# Altium project INCUBATION_CONTROLLER.PrjPcb
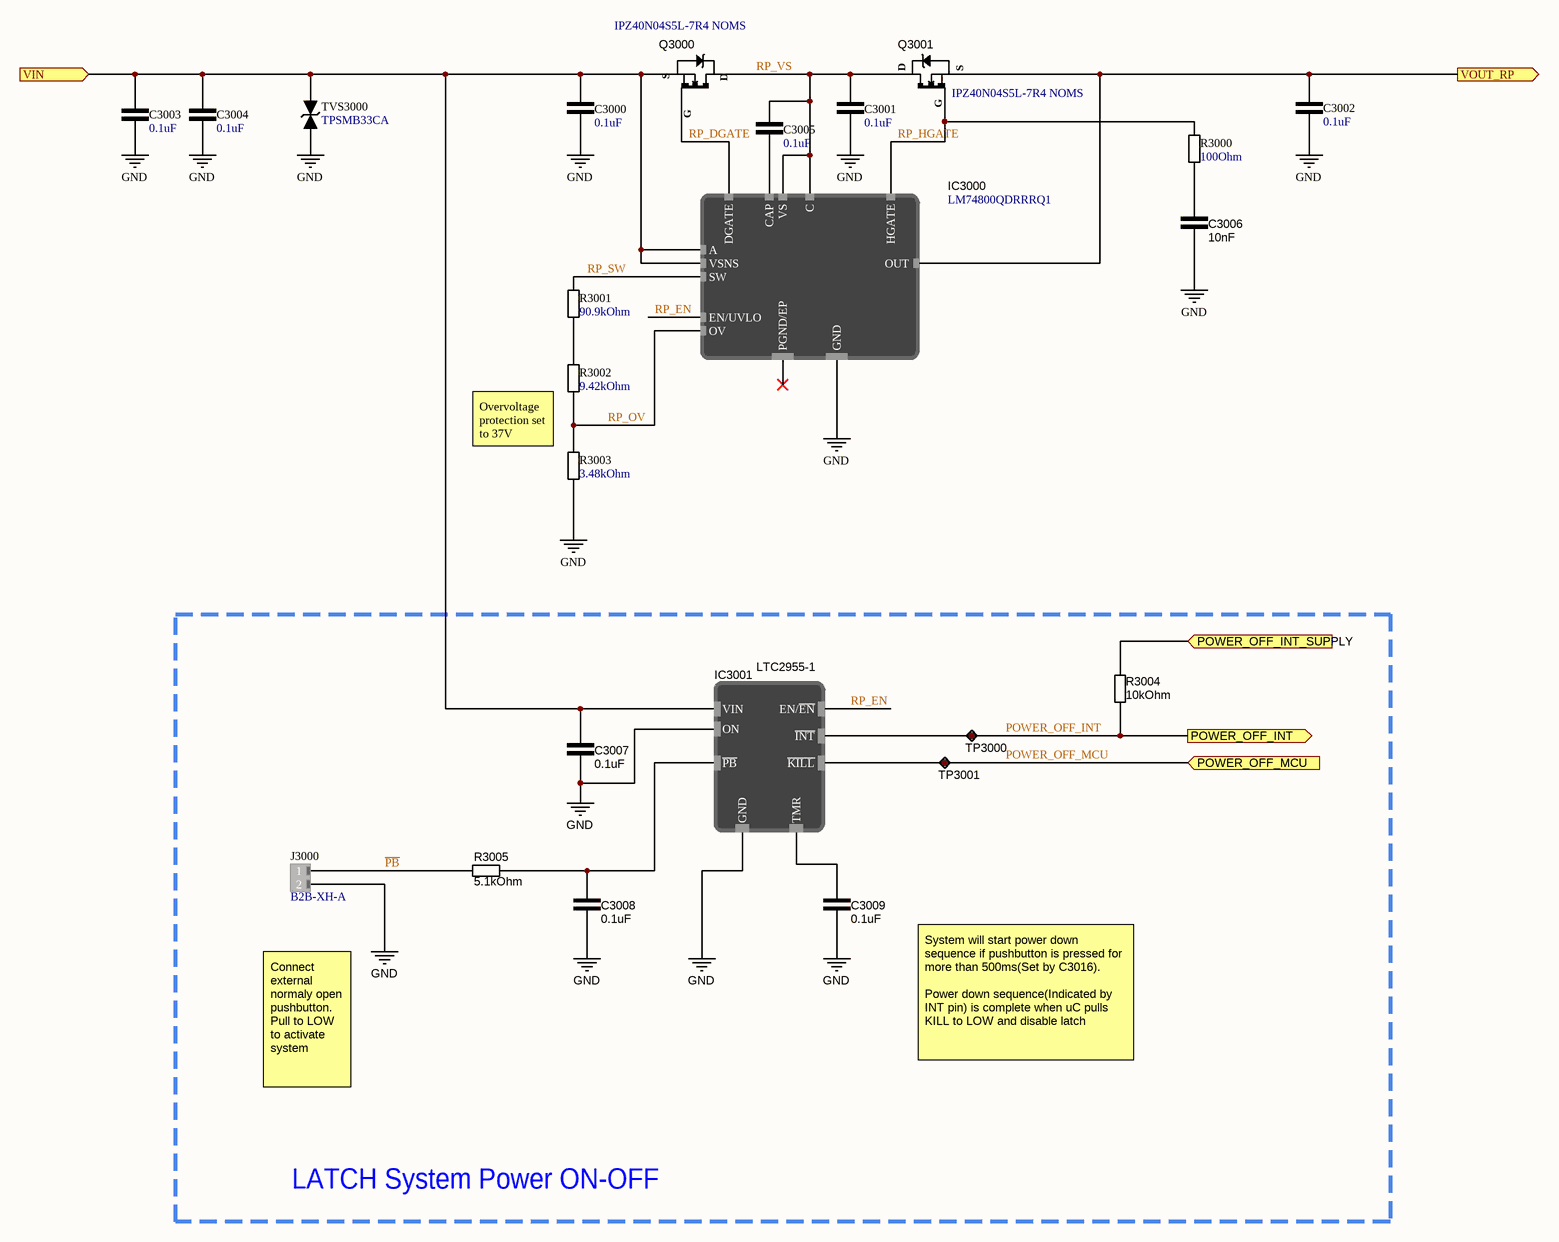
[diagram p0: REVERSE_PROTECTION.SchDoc]
8 sheets, 154 parts. Net scope: flat (ports and power ports of the same name join across sheets).
Board file: INCUBATION_CONTROLLER.PcbDoc
Sheets:
  REVERSE_PROTECTION.SchDoc
  5V_SUPPLY.SchDoc
  5V_ISOLATED_SUPPLY.SchDoc
  uSD_CARD.SchDoc
  DISPLAY_INTERFACE.SchDoc
  AC_CONTROL.SchDoc
  MOTOR_CONTROL.SchDoc
  3V3_MCU.SchDoc

## Sheet REVERSE_PROTECTION.SchDoc
size A3; SheetNumber: 3; SheetTotal: 16

### Parts
C3000  0.1uF  [CAP_0603]
C3001  0.1uF  [CAP_0603]
C3002  0.1uF  [CAP_0603]
C3003  0.1uF  [CAP_0603]
C3004  0.1uF  [CAP_0603]
C3005  0.1uF  [CAP_0603]
C3006  10nF  [CAP_0603]
C3007  0.1uF  [CAP_0603]
C3008  0.1uF  [CAP_0603]
C3009  0.1uF  [CAP_0603]
IC3000  LM74800QDRRRQ1  [SON50P300X80_HS-13N]
IC3001  LTC2955-1  [TSOP65P280X100-8N]
J3000  B2B-XH-A  [JST_XH_2POS]
Q3000  IPZ40N04S5L-7R4 NOMS  [PG-TSDSON-8-32]
Q3001  IPZ40N04S5L-7R4 NOMS  [PG-TSDSON-8-32]
R3000  100Ohm  [RES_0603]
R3001  90.9kOhm  [RES_0603]
R3002  9.42kOhm  [RES_0603]
R3003  3.48kOhm  [RES_0603]
R3004  10kOhm  [RES_0603]
R3005  5.1kOhm  [RES_0603]
TP3000  Test point  [TestPoint]  (value not drawn)
TP3001  Test point  [TestPoint]  (value not drawn)
TVS3000  TPSMB33CA  [DO-214AA]

### Ports
POWER_OFF_INT (out, see POWER_DELIVERY_AND_MONITORING[2A], POWER_DELIVERY_AND_MONITORING[1B]), POWER_OFF_INT_SUPPLY (in, see POWER_DELIVERY_AND_MONITORING[2A]), POWER_OFF_MCU (in, see POWER_DELIVERY_AND_MONITORING[2A], POWER_DELIVERY_AND_MONITORING[1B]), VIN (in, see POWER_DELIVERY_AND_MONITORING[1A]), VOUT_RP (out, see POWER_DELIVERY_AND_MONITORING[2A])

### Nets
GND: C3000.1 C3001.1 C3002.1 C3003.1 C3004.1 C3006.1 C3007.1 C3008.1 C3009.1 IC3000.7(GND) IC3001.1(ON) IC3001.4(GND) J3000.2 R3003.1 TVS3000.2(Anode)
~{PB}: J3000.1 R3005.1
POWER_OFF_INT: IC3001.8(~{INT}) R3004.1 TP3000.1 ; port POWER_OFF_INT
POWER_OFF_MCU: IC3001.2(~{KILL}) TP3001.1 ; port POWER_OFF_MCU
RP_DGATE: IC3000.1(DGATE) Q3000.G(Gate)
RP_EN: IC3000.6(EN/UVLO) IC3001.7(EN/~{EN})
RP_HGATE: IC3000.8(HGATE) Q3001.G(Gate) R3000.2
RP_OV: IC3000.5(OV) R3002.1 R3003.2
RP_SW: IC3000.4(SW) R3001.2
RP_VS: C3001.2 C3005.2 IC3000.10(VS) IC3000.12(C) Q3000.D(Drain) Q3001.D(Drain)
NetC3000_2: C3000.2 C3003.2 C3004.2 C3007.2 IC3000.2(A) IC3000.3(VSNS) IC3001.6(VIN) Q3000.S(Source) TVS3000.1(Cathode) ; port VIN
NetC3002_2: C3002.2 IC3000.9(OUT) Q3001.S(Source) ; port VOUT_RP
NetC3005_1: C3005.1 IC3000.11(CAP)
NetC3006_2: C3006.2 R3000.1
NetC3008_2: C3008.2 IC3001.5(~{PB}) R3005.2
NetC3009_2: C3009.2 IC3001.3(TMR)
NetR3001_1: R3001.1 R3002.2
NetR3004_2: R3004.2 ; port POWER_OFF_INT_SUPPLY

Not connected (* = marked no-connect by the designer): IC3000 13(PGND/EP)*

### Notes on the sheet
- Overvoltage protection set to 37V
- Connect external normaly open pushbutton.
  Pull to LOW to activate system
- System will start power down sequence if pushbutton is pressed for more than 500ms(Set by C3016).
  Power down sequence(Indicated by INT pin) is complete when uC pulls KILL to LOW and disable latch
- LATCH System Power ON-OFF

### Library data of the parts
C3000 C3001 C3005 C3007-C3009 = C000018: 0.1 µF ±10% 50V Ceramic Capacitor X7R 0603 (1608 Metric); ComponentLink1Description: DigiKey; ComponentLink1URL: https://www.digikey.com/en/products/detail/samsung-electro-mechanics/CL10B104KB8NNNC/3886658; DigiKey Part Number: 1276-1000-1-ND; capacitance: 0.1uF
C3002-C3004 = C000018: 0.1 µF ±10% 50V Ceramic Capacitor X7R 0603 (1608 Metric); Manufacturer Product Number: CL10B104KB8NNNC; capacitance: 0.1uF; ComponentLink1Description: DigiKey; ComponentLink1URL: https://www.digikey.com/en/products/detail/samsung-electro-mechanics/CL10B104KB8NNNC/3886658; DigiKey Part Number: 1276-1000-1-ND
C3006 = C000034: 10000 pF ±10% 50V Ceramic Capacitor X7R 0603 (1608 Metric); ComponentLink1Description: DigiKey; ComponentLink1URL: https://www.digikey.com/en/products/detail/kemet/C0603C103K5RACTU/411090; DigiKey Part Number: 399-C0603C103K5RACTUCT-ND; capacitance: 10nF
IC3000 = LM74800QDRRRQ1: OR Controller N+1 ORing Controller N-Channel 1:1 12-WSON (3x3); DigiKey Part Number: 296-LM74800QDRRRQ1CT-ND; ComponentLink1Description: DigiKey; ComponentLink1URL: https://www.digikey.com/en/products/detail/texas-instruments/LM74800QDRRRQ1/13627158; Mouser Part Number: 595-LM74800QDRRRQ1; ComponentLink2Description: Mouser; ComponentLink2URL: https://eu.mouser.com/ProductDetail/Texas-Instruments/LM74800QDRRRQ1?qs=KUoIvG%2F9IlYNgS7D9vQjYA%3D%3D
IC3001 = LTC2955-1: Power Supply Controller Push Button, On/Off Controller TSOT-23-8; DigiKey Part Number: 505-LTC2955CTS8-1#TRMPBFCT-ND; ComponentLink1Description: DigiKey; ComponentLink1URL: https://www.digikey.com/en/products/detail/analog-devices-inc/LTC2955CTS8-1-TRMPBF/3065178; Mouser Part Number: 584-C2955CTS8-1TMPF; ComponentLink2Description: Mouser; ComponentLink2URL: https://eu.mouser.com/ProductDetail/Analog-Devices/LTC2955CTS8-1TRMPBF?qs=hVkxg5c3xu%252B6Fq1Ir3bkGg%3D%3D
J3000 = 00000013: Connector Header Through Hole 2 position 0.098" (2.50mm); DigiKey Part Number: 455-B2B-XH-A-ND; ComponentLink1Description: DigiKey; ComponentLink1URL: https://www.digikey.com/en/products/detail/jst-sales-america-inc/B2B-XH-A/1651045; Manufacturer Product Number: B2B-XH-A
Q3000 Q3001 = 00000007: N-Channel 40 V 40A (Tc) 34W (Tc) Surface Mount PG-TSDSON-8; DigiKey Part Number: IPZ40N04S5L7R4ATMA1CT-ND; Mouser Part Number: 726-IPZ40N04S5L7R4AT; ComponentLink1Description: DigiKey; ComponentLink1URL: https://www.digikey.com/en/products/detail/infineon-technologies/IPZ40N04S5L7R4ATMA1/5960382; ComponentLink2Description: Mouser; ComponentLink2URL: https://eu.mouser.com/ProductDetail/Infineon-Technologies/IPZ40N04S5L7R4ATMA1?qs=RJIhqtkBntMJfptUOROQRQ%3D%3D; ComponentLink3Description: Footprint Drawing; ComponentLink3URL: https://www.infineon.com/cms/en/product/packages/PG-TSDSON/PG-TSDSON-8-32/#!downloads
R3000 = R000030: 100 Ohms ±1% 0.1W, 1/10W Chip Resistor 0603 (1608 Metric) Moisture Resistant Thick Film; ComponentLink1Description: DigiKey; ComponentLink1URL: https://www.digikey.com/en/products/detail/yageo/RC0603FR-07100RL/726888; resistance: 100Ohm; DigiKey Part Number: 311-100HRCT-ND
R3001 = R000027: 90.9 kOhms ±1% 0.1W, 1/10W Chip Resistor 0603 (1608 Metric) Automotive AEC-Q200 Thick Film; ComponentLink1Description: DigiKey; ComponentLink1URL: https://www.digikey.com/en/products/detail/panasonic-electronic-components/ERJ-3EKF9092V/196512; resistance: 90.9kOhm; DigiKey Part Number: P90.9KHCT-ND
R3002 = R000028: 9.42 kOhms ±1% 0.1W, 1/10W Chip Resistor 0603 (1608 Metric) Automotive AEC-Q200, Moisture Resistant Metal Film; ComponentLink1Description: DigiKey; ComponentLink1URL: https://www.digikey.com/en/products/detail/koa-speer-electronics-inc/RN73H1JTTD9421F25/10688584?s=N4IgjCBcoMxaBjKAzAhgGwM4FMA0IB7KAbXDBggF18AHAFyhAGU6AnASwDsBzEAX3xgAbPBBJIaLHkIkQMAJwAmACwjqIeoxYce-fIoAMADgCso8ZJz4ikUvIB0yxQAIA1gHkAFgFtMIdZqQIACqnOx07sgAstiomACurNh6IAC0iuZQbPHSNqRmlHwCIBm2IEmY7Jh0BKz%2BfEA; resistance: 9.42kOhm; DigiKey Part Number: 2019-RN73H1JTTD9421F25CT-ND
R3003 = R000029: 3.48 kOhms ±1% 0.1W, 1/10W Chip Resistor 0603 (1608 Metric) Automotive AEC-Q200 Thick Film; ComponentLink1Description: DigiKey; ComponentLink1URL: https://www.digikey.com/en/products/detail/stackpole-electronics-inc/RMCF0603FT3K48/1761028; resistance: 3.48kOhm; DigiKey Part Number: RMCF0603FT3K48CT-ND
R3004 = R000001: 10 kOhms ±1% 0.125W, 1/8W Chip Resistor 0603 (1608 Metric) Anti-Sulfur Thin Film; resistance: 10kOhm; ComponentLink1Description: DigiKey; ComponentLink1URL: https://www.digikey.com/en/products/detail/vishay-beyschlag-draloric-bc-components/MCT06030C1002FP500/1850440; DigiKey Part Number: MCT0603-10.0K-CFCT-ND
R3005 = R000013: 5.1 kOhms ±1% 0.1W, 1/10W Chip Resistor 0603 (1608 Metric) Moisture Resistant Thick Film; ComponentLink1Description: DigiKey; ComponentLink1URL: https://www.digikey.com/en/products/detail/yageo/RC0603FR-075K1L/727268; resistance: 5.1kOhm; DigiKey Part Number: 311-5.10KHRCT-ND
TP3000 TP3001 = TP002: Test point 1mm
TVS3000 = 00000015: 45.7V Clamp 13.3A Ipp Tvs Diode Surface Mount DO-214AA (SMBJ); DigiKey Part Number: F6323CT-ND; ComponentLink1Description: DigiKey; ComponentLink1URL: https://www.digikey.com/en/products/detail/littelfuse-inc/TPSMB33CA/4835275; Manufacturer Product Number: TPSMB33CA; JLCPCB Part Number: C224085

## Sheet 5V_SUPPLY.SchDoc
size A4; SheetNumber: 5; SheetTotal: 16
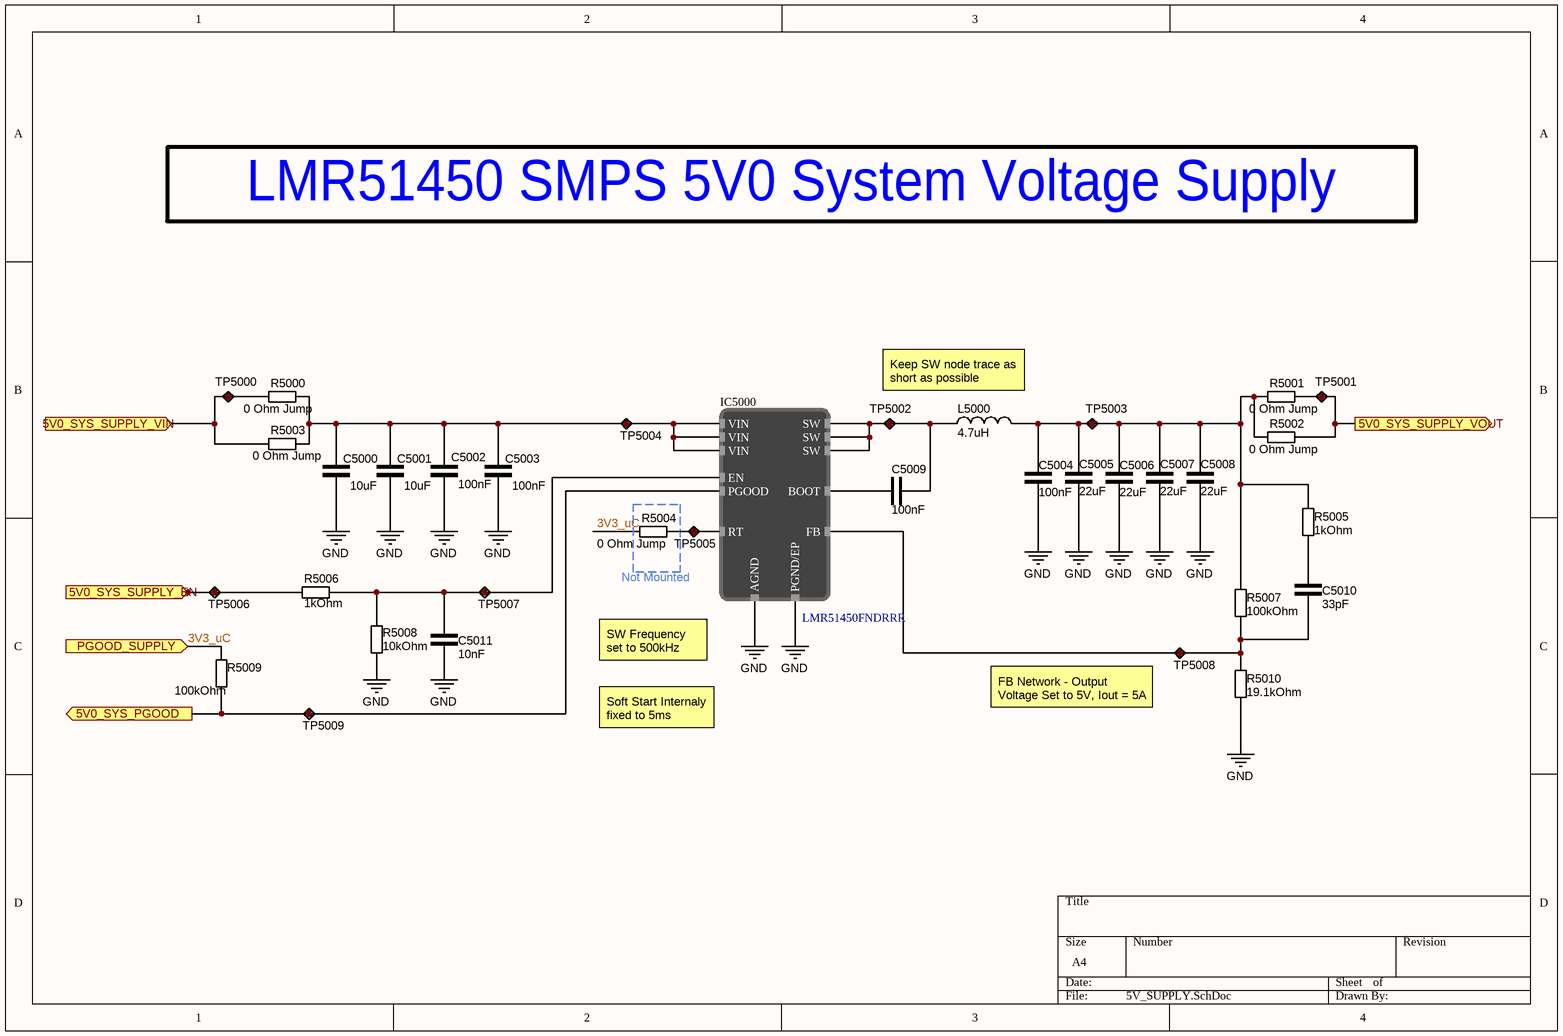
[diagram p1: 5V_SUPPLY.SchDoc]

### Parts
C5000  10uF  [CAP_0805]
C5001  10uF  [CAP_0805]
C5002  100nF  [CAP_0603]
C5003  100nF  [CAP_0603]
C5004  100nF  [CAP_0603]
C5005  22uF  [CAP_0805]
C5006  22uF  [CAP_0805]
C5007  22uF  [CAP_0805]
C5008  22uF  [CAP_0805]
C5009  100nF  [CAP_0603]
C5010  33pF  [CAP_0603]
C5011  10nF  [CAP_0603]
IC5000  LMR51450FNDRRR  [SON50P300X80_HS-13N]
L5000  4.7uH  [INDP6965X30N]
R5000  0 Ohm Jump  [RES_0805]
R5001  0 Ohm Jump  [RES_1206]
R5002  0 Ohm Jump  [RES_1206]
R5003  0 Ohm Jump  [RES_0805]
R5004  0 Ohm Jump  [RES_0603]
R5005  1kOhm  [RES_0603]
R5006  1kOhm  [RES_0603]
R5007  100kOhm  [RES_0603]
R5008  10kOhm  [RES_0603]
R5009  100kOhm  [RES_0603]
R5010  19.1kOhm  [RES_0603]
TP5000  Test point  [TestPoint]  (value not drawn)
TP5001  Test point  [TestPoint]  (value not drawn)
TP5002  Test point  [TestPoint]  (value not drawn)
TP5003  Test point  [TestPoint]  (value not drawn)
TP5004  Test point  [TestPoint]  (value not drawn)
TP5005  Test point  [TestPoint]  (value not drawn)
TP5006  Test point  [TestPoint]  (value not drawn)
TP5007  Test point  [TestPoint]  (value not drawn)
TP5008  Test point  [TestPoint]  (value not drawn)
TP5009  Test point  [TestPoint]  (value not drawn)

### Ports
5V0_SYS_PGOOD (out, see POWER_DELIVERY_AND_MONITORING[3B]), 5V0_SYS_SUPPLY_EN (in, see POWER_DELIVERY_AND_MONITORING[3B]), 5V0_SYS_SUPPLY_VIN (in, see POWER_DELIVERY_AND_MONITORING[3B]), 5V0_SYS_SUPPLY_VOUT (out, see POWER_DELIVERY_AND_MONITORING[3B]), PGOOD_SUPPLY (in, see POWER_DELIVERY_AND_MONITORING[3B])

### Nets
GND: C5000.1 C5001.1 C5002.2 C5003.1 C5004.1 C5005.1 C5006.2 C5007.1 C5008.1 C5011.1 IC5000.8(AGND) IC5000.13(PGND/EP) R5008.1 R5010.1
3V3_uC: R5004.1 R5009.2 ; port PGOOD_SUPPLY
NetC5000_2: C5000.2 C5001.2 C5002.1 C5003.2 IC5000.10(VIN) IC5000.11(VIN) IC5000.12(VIN) R5000.2 R5003.2 TP5004.1
NetC5004_2: C5004.2 C5005.2 C5006.1 C5007.2 C5008.2 L5000.2 R5001.1 R5002.1 R5005.2 R5007.2 TP5003.1
NetC5009_1: C5009.1 IC5000.4(BOOT)
NetC5009_2: C5009.2 IC5000.1(SW) IC5000.2(SW) IC5000.3(SW) L5000.1 TP5002.1
NetC5010_1: C5010.1 IC5000.7(FB) R5007.1 R5010.2 TP5008.1
NetC5010_2: C5010.2 R5005.1
NetC5011_2: C5011.2 IC5000.9(EN) R5006.2 R5008.2 TP5007.1
NetIC5000_5: IC5000.5(PGOOD) R5009.1 TP5009.1 ; port 5V0_SYS_PGOOD
NetIC5000_6: IC5000.6(RT) R5004.2 TP5005.1
NetR5000_1: R5000.1 R5003.1 TP5000.1 ; port 5V0_SYS_SUPPLY_VIN
NetR5001_2: R5001.2 R5002.2 TP5001.1 ; port 5V0_SYS_SUPPLY_VOUT
NetR5006_1: R5006.1 TP5006.1 ; port 5V0_SYS_SUPPLY_EN

### Notes on the sheet
- LMR51450 SMPS 5V0 System Voltage Supply
- Keep SW node trace as short as possible
- Not Mounted
- (near IC5000) SW Frequency set to 500kHz
- (near TP5008) FB Network - Output Voltage Set to 5V, Iout = 5A
- Soft Start Internaly fixed to 5ms

### Library data of the parts
C5000 C5001 = C000002: 10 µF ±10% 25V Ceramic Capacitor X5R 0805 (2012 Metric); ComponentLink1Description: DigiKey; ComponentLink1URL: https://www.digikey.com/en/products/detail/tdk-corporation/C2012X5R1E106K125AB/2443462; DigiKey Part Number: 445-5984-1-ND; capacitance: 10uF
C5002-C5004 C5009 = C000007: 0.1 µF ±10% 25V Ceramic Capacitor X7R 0603 (1608 Metric); ComponentLink1Description: DigiKey; ComponentLink1URL: https://www.digikey.com/en/products/detail/kyocera-avx/06033C104K4T2A/8019250; DigiKey Part Number: 478-KAM15AR71E104KTCT-ND; capacitance: 100nF
C5005-C5008 = C000001: 22 µF ±20% 25V Ceramic Capacitor X5R 0805 (2012 Metric); ComponentLink1Description: DigiKey; ComponentLink1URL: https://www.digikey.com/en/products/detail/tdk-corporation/C2012X5R1E226M125AC/3661564; DigiKey Part Number: 445-9112-1-ND; capacitance: 22uF
C5010 = C000029: 33 pF ±5% 25V Ceramic Capacitor C0G, NP0 0603 (1608 Metric); ComponentLink1Description: DigiKey; ComponentLink1URL: https://www.digikey.com/en/products/detail/yageo/CC0603JRNPO8BN330/5883595; DigiKey Part Number: 311-3954-1-ND; capacitance: 33pF
C5011 = C000005: 10000 pF ±20% 25V Ceramic Capacitor X7R 0603 (1608 Metric); ComponentLink1Description: DigiKey; ComponentLink1URL: https://www.digikey.com/en/products/detail/kyocera-avx/06033C103MAT2A/1599370; DigiKey Part Number: 478-KGM15AR71E103MTCT-ND; capacitance: 10nF
IC5000 = LMR51450FNDRRR: Buck Switching Regulator IC Positive Adjustable 0.8V 1 Output 5A 12-WFDFN Exposed Pad; DigiKey Part Number: 296-LMR51450FNDRRRCT-ND; ComponentLink1Description: DigiKey; ComponentLink1URL: https://www.digikey.com/en/products/detail/texas-instruments/LMR51450FNDRRR/17395218; Mouser Part Number: 595-LMR51450FNDRRR; ComponentLink2Description: Mouser; ComponentLink2URL: https://eu.mouser.com/ProductDetail/Texas-Instruments/LMR51450FNDRRR?qs=rQFj71Wb1eVWWBj0Ni4OAA%3D%3D; Manufacturer Product Number: LMR51450FNDRRR; JLCPCB Part Number: C5782413
L5000 = L000011: FIXED IND 4.7UH 5.5A 40 MOHM SMD; inductance: 4.7uH; DigiKey Part Number: 541-1010-1-ND; ComponentLink1Description: DigiKey; ComponentLink1URL: https://www.digikey.com/en/products/detail/vishay-dale/IHLP2525CZER4R7M01/1220675
R5000 R5003 = R000011: 0 Ohms Jumper Chip Resistor 0805 (2012 Metric) Automotive AEC-Q200 Thick Film; ComponentLink1Description: DigiKey; ComponentLink1URL: https://www.digikey.com/en/products/detail/panasonic-electronic-components/ERJ-6GEY0R00V/78163; resistance: 0 Ohm Jump; DigiKey Part Number: P0.0ACT-ND
R5001 R5002 = R000012: 0 Ohms Jumper Chip Resistor 1206 (3216 Metric) Automotive AEC-Q200 Thick Film; ComponentLink1Description: DigiKey; ComponentLink1URL: https://www.digikey.com/en/products/detail/stackpole-electronics-inc/RMCF1206ZT0R00/1756906; resistance: 0 Ohm Jump; DigiKey Part Number: RMCF1206ZT0R00CT-ND
R5004 = R000007: 0 Ohms Jumper Chip Resistor 0603 (1608 Metric) Automotive AEC-Q200 Thick Film; ComponentLink1Description: DigiKey; ComponentLink1URL: https://www.digikey.com/en/products/detail/stackpole-electronics-inc/RMCF0603ZT0R00/1756908; resistance: 0 Ohm Jump; DigiKey Part Number: RMCF0603ZT0R00CT-ND
R5005 R5006 = R000004: 1 kOhms ±1% 0.125W, 1/8W Chip Resistor 0603 (1608 Metric) Anti-Sulfur Thin Film; resistance: 1kOhm; ComponentLink1Description: DigiKey; ComponentLink1URL: https://www.digikey.com/en/products/detail/vishay-beyschlag-draloric-bc-components/MCT06030C1001FP500/2607821; DigiKey Part Number: MCT0603-1.00K-CFCT-ND
R5007 R5009 = R000006: 100 kOhms ±1% 0.1W, 1/10W Chip Resistor 0603 (1608 Metric) Automotive AEC-Q200 Thick Film; resistance: 100kOhm; ComponentLink1Description: DigiKey; ComponentLink1URL: https://www.digikey.com/en/products/detail/stackpole-electronics-inc/RMCF0603FG100K/1713543; DigiKey Part Number: RMCF0603FG100KCT-ND
R5008 = R000001: as R3004 on sheet REVERSE_PROTECTION; resistance: 10kOhm; ComponentLink1Description: DigiKey; ComponentLink1URL: https://www.digikey.com/en/products/detail/vishay-beyschlag-draloric-bc-components/MCT06030C1002FP500/1850440; DigiKey Part Number: MCT0603-10.0K-CFCT-ND
R5010 = R000020: 19.1 kOhms ±1% 0.1W, 1/10W Chip Resistor 0603 (1608 Metric) Moisture Resistant Thick Film; ComponentLink1Description: DigiKey; ComponentLink1URL: https://www.digikey.com/en/products/detail/yageo/RC0603FR-0719K1L/727001; resistance: 19.1kOhm; DigiKey Part Number: 311-19.1KHRCT-ND
TP5000-TP5009 = TP002: Test point 1mm

## Sheet 5V_ISOLATED_SUPPLY.SchDoc
size A4; SheetNumber: 6; SheetTotal: 16
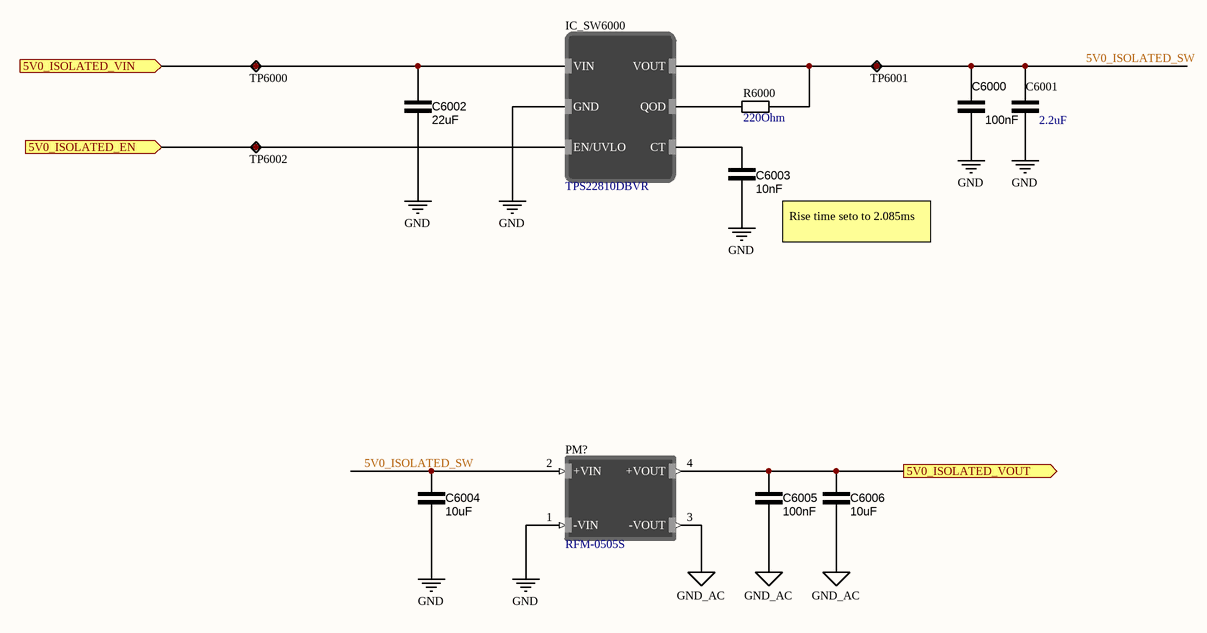
[diagram p2: 5V_ISOLATED_SUPPLY.SchDoc]

### Parts
C6000  100nF  [CAP_0603]
C6001  2.2uF  [CAP_0603]
C6002  22uF  [CAP_0805]
C6003  10nF  [CAP_0603]
C6004  10uF  [CAP_0805]
C6005  100nF  [CAP_0603]
C6006  10uF  [CAP_0805]
IC_SW6000  TPS22810DBVR  [SOT95P280X145-6N]
PM?  RFM-0505S  [CONV_RFM-0505S]
R6000  220Ohm  [RES_0603]
TP6000  Test point  [TestPoint]  (value not drawn)
TP6001  Test point  [TestPoint]  (value not drawn)
TP6002  Test point  [TestPoint]  (value not drawn)

### Ports
5V0_ISOLATED_EN (in, see POWER_DELIVERY_AND_MONITORING[2C]), 5V0_ISOLATED_VIN (in, see POWER_DELIVERY_AND_MONITORING[2C]), 5V0_ISOLATED_VOUT (out, see POWER_DELIVERY_AND_MONITORING[2C])

### Nets
GND: C6000.2 C6001.1 C6002.1 C6003.1 C6004.1 IC_SW6000.2(GND) PM?.1(-VIN)
GND_AC: C6005.1 C6006.1 PM?.3(-VOUT)
5V0_ISOLATED_SW: C6000.1 C6001.2 C6004.2 IC_SW6000.6(VOUT) PM?.2(+VIN) R6000.2 TP6001.1
NetC6002_2: C6002.2 IC_SW6000.1(VIN) TP6000.1 ; port 5V0_ISOLATED_VIN
NetC6003_2: C6003.2 IC_SW6000.4(CT)
NetC6005_2: C6005.2 C6006.2 PM?.4(+VOUT) ; port 5V0_ISOLATED_VOUT
NetIC_SW6000_3: IC_SW6000.3(EN/UVLO) TP6002.1 ; port 5V0_ISOLATED_EN
NetIC_SW6000_5: IC_SW6000.5(QOD) R6000.1

### Notes on the sheet
- (near C6003) Rise time seto to 2.085ms

### Library data of the parts
C6000 = C000007: as C5002 on sheet 5V_SUPPLY; ComponentLink1Description: DigiKey; ComponentLink1URL: https://www.digikey.com/en/products/detail/kyocera-avx/06033C104K4T2A/8019250; DigiKey Part Number: 478-KAM15AR71E104KTCT-ND; capacitance: 100nF
C6001 = C000014: 8 pF ±0.05pF 25V Ceramic Capacitor C0G, NP0 01005 (0402 Metric); ComponentLink1Description: DigiKey; ComponentLink1URL: https://www.digikey.com/en/products/detail/murata-electronics/GRM188C71C225KE11D/4905311; DigiKey Part Number: 490-12731-1-ND; capacitance: 2.2uF
C6002 = C000001: as C5005 on sheet 5V_SUPPLY; ComponentLink1Description: DigiKey; ComponentLink1URL: https://www.digikey.com/en/products/detail/tdk-corporation/C2012X5R1E226M125AC/3661564; DigiKey Part Number: 445-9112-1-ND; capacitance: 22uF
C6003 = C000005: as C5011 on sheet 5V_SUPPLY; ComponentLink1Description: DigiKey; ComponentLink1URL: https://www.digikey.com/en/products/detail/kyocera-avx/06033C103MAT2A/1599370; DigiKey Part Number: 478-KGM15AR71E103MTCT-ND; capacitance: 10nF
C6004 C6006 = C000002: 10 µF ±10% 25V Ceramic Capacitor X5R 0805 (2012 Metric); Manufacturer Product Number: C2012X5R1E106K125AB; capacitance: 10uF; ComponentLink1Description: DigiKey; ComponentLink1URL: https://www.digikey.com/en/products/detail/tdk-corporation/C2012X5R1E106K125AB/2443462; DigiKey Part Number: 445-5984-1-ND
C6005 = C000007: 0.1 µF ±10% 25V Ceramic Capacitor X7R 0603 (1608 Metric); Manufacturer Product Number: KAM15AR71E104KT; capacitance: 100nF; ComponentLink1Description: DigiKey; ComponentLink1URL: https://www.digikey.com/en/products/detail/kyocera-avx/06033C104K4T2A/8019250; DigiKey Part Number: 478-KAM15AR71E104KTCT-ND
IC_SW6000 = TPS22810: Power Switch/Driver 1:1 N-Channel 2A SOT-23-6; DigiKey Part Number: 296-45297-1-ND; Mouser Part Number: 595-TPS22810DBVR; ComponentLink1Description: DigiKey; ComponentLink1URL: https://www.digikey.com/en/products/detail/texas-instruments/TPS22810DBVR/6595640; ComponentLink2Description: Mouser; ComponentLink2URL: https://eu.mouser.com/ProductDetail/Texas-Instruments/TPS22810DBVR?qs=34RfhUjJmKcFqeJVMZZhPA%3D%3D
PM? = RFM-0505S: Isolated Module DC DC Converter 1 Output 5V 200mA - 5V Input; DigiKey Part Number: 945-3159-ND; Mouser Part Number: 919-RFM-0505S; Manufacturer Product Number: RFM-0505S; JLCPCB Part Number: C22371855; ComponentLink1Description: DigiKey; ComponentLink1URL: https://www.digikey.com/en/products/detail/recom-power/RFM-0505S/8550767; ComponentLink2Description: Mouser; ComponentLink2URL: https://eu.mouser.com/ProductDetail/RECOM-Power/RFM-0505S?qs=lYGu3FyN48dRVYKTH5ipqg%3D%3D
R6000 = R000021: 220 Ohms ±5% 0.1W, 1/10W Chip Resistor 0603 (1608 Metric) Automotive AEC-Q200 Thick Film; ComponentLink1Description: DigiKey; ComponentLink1URL: https://www.digikey.com/en/products/detail/panasonic-electronic-components/ERJ-3GEYJ221V/135719; resistance: 220Ohm; DigiKey Part Number: P220GCT-ND
TP6000-TP6002 = TP002: Test point 1mm

## Sheet uSD_CARD.SchDoc
size A4; SheetNumber: 9; SheetTotal: 16
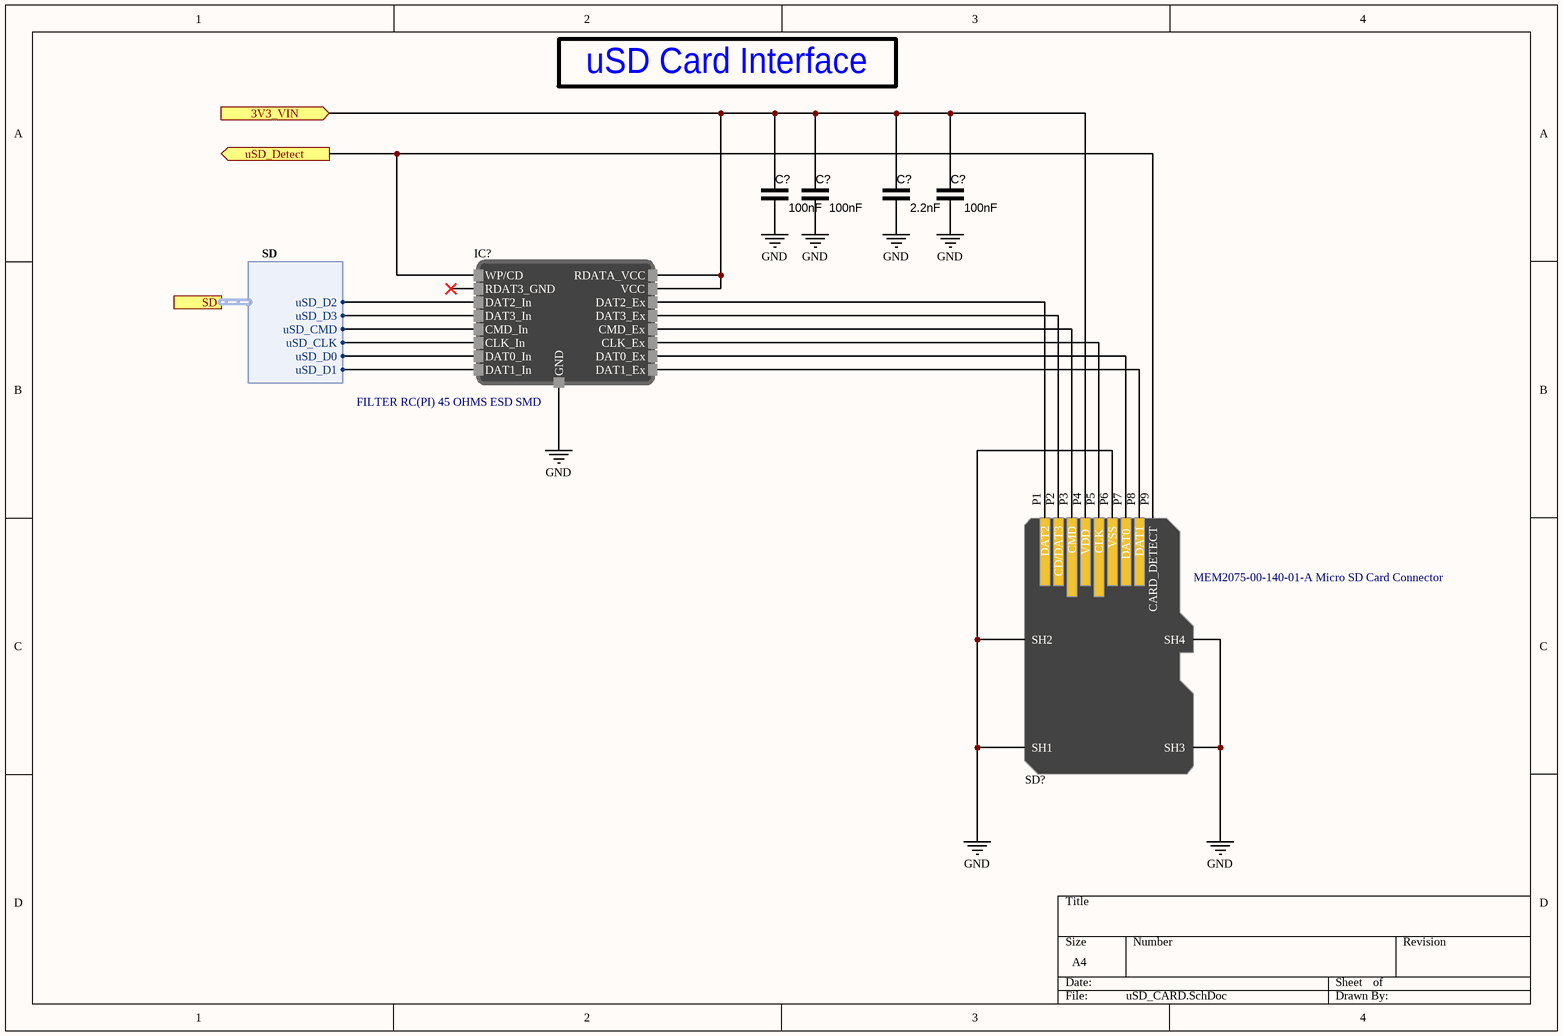
[diagram p3: uSD_CARD.SchDoc]

### Parts
(Parts that share a designator on the sheet are numbered #1, #2 ... from top to bottom, then left to right.)
C?#1  100nF  [CAP_0603]
C?#2  100nF  [CAP_0603]
C?#3  2.2nF  [CAP_0603]
C?#4  100nF  [CAP_0603]
IC?#1  FILTER RC(PI) 45 OHMS ESD SMD  [Micro QFN 3.5x1.2-16L]
SD?  MEM2075-00-140-01-A Micro SD Card Connector  [uSD_CARD_9(8+1)]

### Ports
3V3_VIN (in), SD (harness SD), uSD_Detect (out)

### Harnesses
SD: uSD_D2, uSD_D3, uSD_CMD, uSD_CLK, uSD_D0, uSD_D1

### Nets
GND: C?#1.1 C?#2.1 C?#3.1 C?#4.1 IC?#1.17(GND) SD?.P6(VSS) SD?.SH1 SD?.SH2 SD?.SH3 SD?.SH4
NetC?#1_2: C?#1.2 C?#2.2 C?#3.2 C?#4.2 IC?#1.15(VCC) IC?#1.16(RDATA_VCC) SD?.P4(VDD) ; port 3V3_VIN
NetIC?#1_1: IC?#1.1(WP/CD) SD?.P9(CARD_DETECT) ; port uSD_Detect
NetIC?#1_3: IC?#1.3(DAT2_In) ; port SD.uSD_D2
NetIC?#1_4: IC?#1.4(DAT3_In) ; port SD.uSD_D3
NetIC?#1_5: IC?#1.5(CMD_In) ; port SD.uSD_CMD
NetIC?#1_6: IC?#1.6(CLK_In) ; port SD.uSD_CLK
NetIC?#1_7: IC?#1.7(DAT0_In) ; port SD.uSD_D0
NetIC?#1_8: IC?#1.8(DAT1_In) ; port SD.uSD_D1
NetIC?#1_9: IC?#1.9(DAT1_Ex) SD?.P8(DAT1)
NetIC?#1_10: IC?#1.10(DAT0_Ex) SD?.P7(DAT0)
NetIC?#1_11: IC?#1.11(CLK_Ex) SD?.P5(CLK)
NetIC?#1_12: IC?#1.12(CMD_Ex) SD?.P3(CMD)
NetIC?#1_13: IC?#1.13(DAT3_Ex) SD?.P2(CD/DAT3)
NetIC?#1_14: IC?#1.14(DAT2_Ex) SD?.P1(DAT2)

Not connected (* = marked no-connect by the designer): IC?#1 2(RDAT3_GND)*

### Notes on the sheet
- uSD Card Interface

### Library data of the parts
C?#1 C?#2 C?#4 = C000007: as C5002 on sheet 5V_SUPPLY; ComponentLink1Description: DigiKey; ComponentLink1URL: https://www.digikey.com/en/products/detail/kyocera-avx/06033C104K4T2A/8019250; DigiKey Part Number: 478-KAM15AR71E104KTCT-ND; capacitance: 100nF
C?#3 = C000006: 2200 pF ±10% 25V Ceramic Capacitor X7R 0603 (1608 Metric); ComponentLink1Description: DigiKey; ComponentLink1URL: https://www.digikey.com/en/products/detail/yageo/CC0603KRX7R8BB222/2345066; DigiKey Part Number: 311-3653-1-ND; capacitance: 2.2nF
IC?#1 = EMIF06-MSD02N16: RC (Pi) EMI Filter 2nd Order Low Pass 6 Channel R = 45Ohms, C = 20pF (Total) 16-UFDFN Exposed Pad; Digikey Part Number: 497-8751-1-ND; Digikey Link: https://www.digikey.com/en/products/detail/stmicroelectronics/EMIF06-MSD02N16/2043592?s=N4IgTCBcDaIKIFkCSAxADANgLQIMoBE0wA5ARgxAF0BfIA
SD? = 00000015: 9 (8 + 1) Position Card Connector Secure Digital - microSD™ Surface Mount, Right Angle Gold; DigiKey Part Number: 2073-MEM2075-00-140-01-ACT-ND; Mouser Part Number: 640-MEM20750014001A; ComponentLink1Description: DigiKey; ComponentLink1URL: https://www.digikey.com/en/products/detail/gct/MEM2075-00-140-01-A/9859614?s=N4IgTCBcDaILIFE5gAwHYCsBaFKsEYAWPFfLAQRAF0BfIA; ComponentLink2Description: Mouser; ComponentLink2URL: https://eu.mouser.com/ProductDetail/GCT/MEM2075-00-140-01-A?qs=KUoIvG%2F9IlZvfWpeERlq3Q%3D%3D

## Sheet DISPLAY_INTERFACE.SchDoc
size A4; SheetNumber: 10; SheetTotal: 16
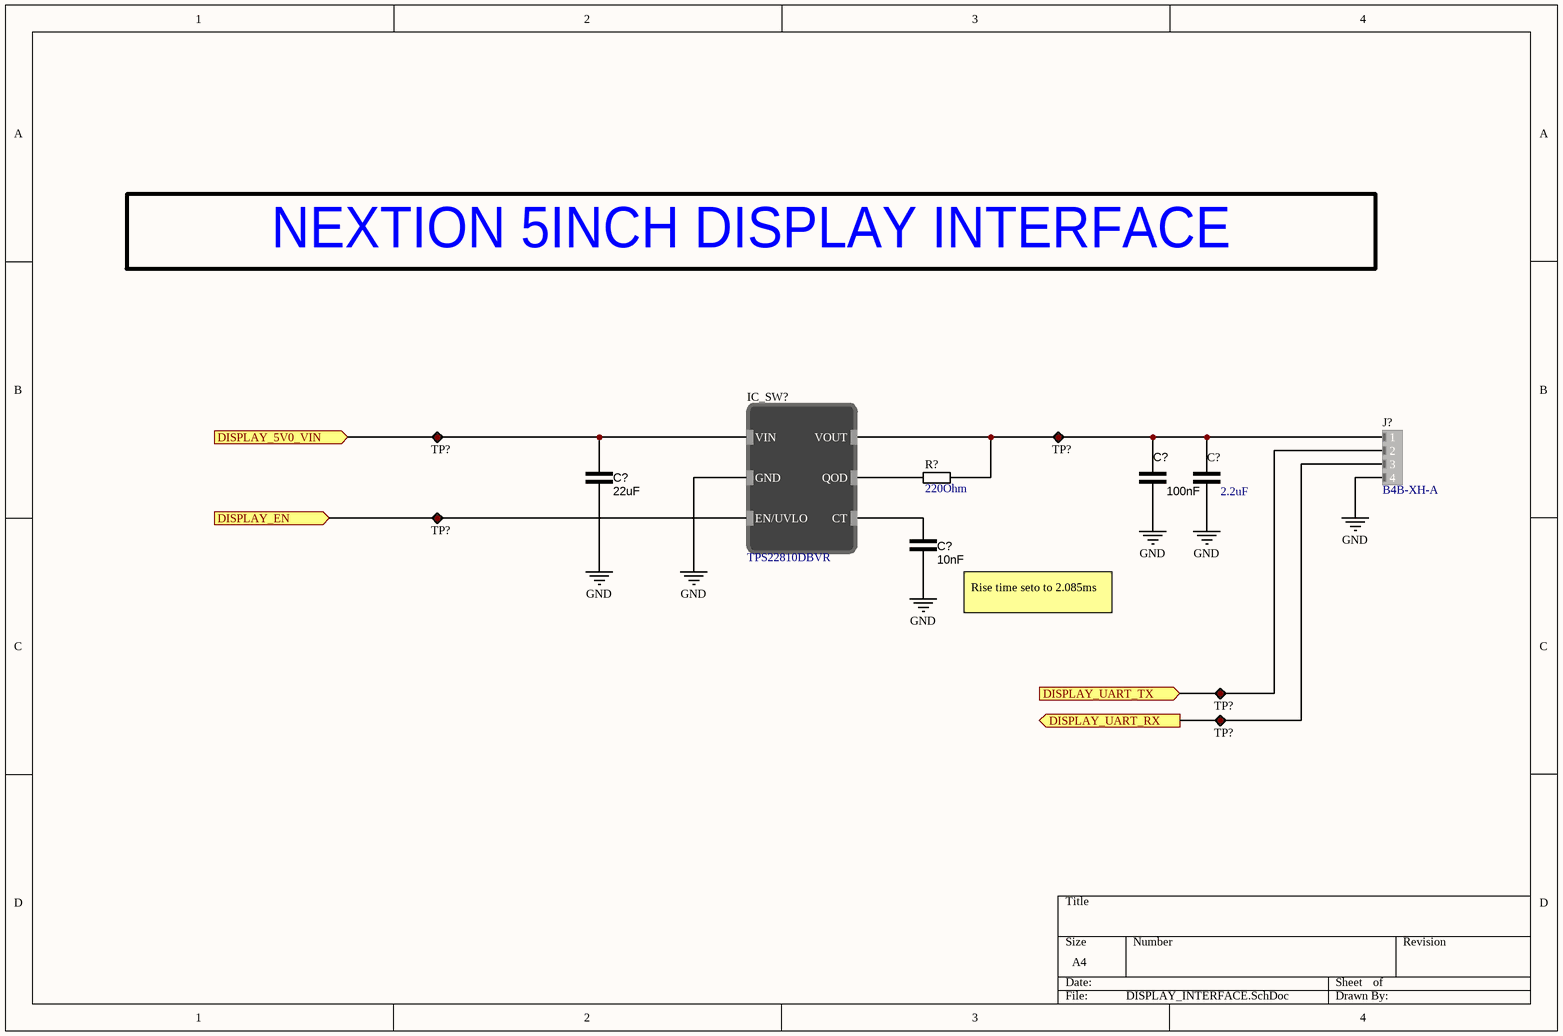
[diagram p4: DISPLAY_INTERFACE.SchDoc]

### Parts
(Parts that share a designator on the sheet are numbered #1, #2 ... from top to bottom, then left to right.)
C?#5  22uF  [CAP_0805]
C?#6  100nF  [CAP_0603]
C?#7  2.2uF  [CAP_0603]
C?#8  10nF  [CAP_0603]
IC_SW?  TPS22810DBVR  [SOT95P280X145-6N]
J?  B4B-XH-A  [JST_XH_4POS]
R?#1  220Ohm  [RES_0603]
TP?#1  Test point  [TestPoint]  (value not drawn)
TP?#2  Test point  [TestPoint]  (value not drawn)
TP?#3  Test point  [TestPoint]  (value not drawn)
TP?#4  Test point  [TestPoint]  (value not drawn)
TP?#5  Test point  [TestPoint]  (value not drawn)

### Ports
DISPLAY_5V0_VIN (in), DISPLAY_EN (in), DISPLAY_UART_RX (out), DISPLAY_UART_TX (in)

### Nets
GND: C?#5.1 C?#6.2 C?#7.1 C?#8.1 IC_SW?.2(GND) J?.4
NetC?#5_2: C?#5.2 IC_SW?.1(VIN) TP?#1.1 ; port DISPLAY_5V0_VIN
NetC?#6_1: C?#6.1 C?#7.2 IC_SW?.6(VOUT) J?.1 R?#1.2 TP?#2.1
NetC?#8_2: C?#8.2 IC_SW?.4(CT)
NetIC_SW?_3: IC_SW?.3(EN/UVLO) TP?#3.1 ; port DISPLAY_EN
NetIC_SW?_5: IC_SW?.5(QOD) R?#1.1
NetJ?_2: J?.2 TP?#4.1 ; port DISPLAY_UART_TX
NetJ?_3: J?.3 TP?#5.1 ; port DISPLAY_UART_RX

### Notes on the sheet
- NEXTION 5INCH DISPLAY INTERFACE
- (near C?#8) Rise time seto to 2.085ms

### Library data of the parts
C?#5 = C000001: as C5005 on sheet 5V_SUPPLY; ComponentLink1Description: DigiKey; ComponentLink1URL: https://www.digikey.com/en/products/detail/tdk-corporation/C2012X5R1E226M125AC/3661564; DigiKey Part Number: 445-9112-1-ND; capacitance: 22uF
C?#6 = C000007: as C5002 on sheet 5V_SUPPLY; ComponentLink1Description: DigiKey; ComponentLink1URL: https://www.digikey.com/en/products/detail/kyocera-avx/06033C104K4T2A/8019250; DigiKey Part Number: 478-KAM15AR71E104KTCT-ND; capacitance: 100nF
C?#7 = C000014: as C6001 on sheet 5V_ISOLATED_SUPPLY; ComponentLink1Description: DigiKey; ComponentLink1URL: https://www.digikey.com/en/products/detail/murata-electronics/GRM188C71C225KE11D/4905311; DigiKey Part Number: 490-12731-1-ND; capacitance: 2.2uF
C?#8 = C000005: as C5011 on sheet 5V_SUPPLY; ComponentLink1Description: DigiKey; ComponentLink1URL: https://www.digikey.com/en/products/detail/kyocera-avx/06033C103MAT2A/1599370; DigiKey Part Number: 478-KGM15AR71E103MTCT-ND; capacitance: 10nF
IC_SW? = TPS22810: as IC_SW6000 on sheet 5V_ISOLATED_SUPPLY; DigiKey Part Number: 296-45297-1-ND; Mouser Part Number: 595-TPS22810DBVR; ComponentLink1Description: DigiKey; ComponentLink1URL: https://www.digikey.com/en/products/detail/texas-instruments/TPS22810DBVR/6595640; ComponentLink2Description: Mouser; ComponentLink2URL: https://eu.mouser.com/ProductDetail/Texas-Instruments/TPS22810DBVR?qs=34RfhUjJmKcFqeJVMZZhPA%3D%3D
J? = 00000014: Connector Header Through Hole 4 position 0.098" (2.50mm); DigiKey Part Number: 455-B4B-XH-A-ND; ComponentLink1Description: DigiKey; ComponentLink1URL: https://www.digikey.com/en/products/detail/jst-sales-america-inc/B4B-XH-A/1651047
R?#1 = R000021: as R6000 on sheet 5V_ISOLATED_SUPPLY; ComponentLink1Description: DigiKey; ComponentLink1URL: https://www.digikey.com/en/products/detail/panasonic-electronic-components/ERJ-3GEYJ221V/135719; resistance: 220Ohm; DigiKey Part Number: P220GCT-ND
TP?#1-TP?#5 = TP002: Test point 1mm

## Sheet AC_CONTROL.SchDoc
size A3; SheetNumber: 12; SheetTotal: 15
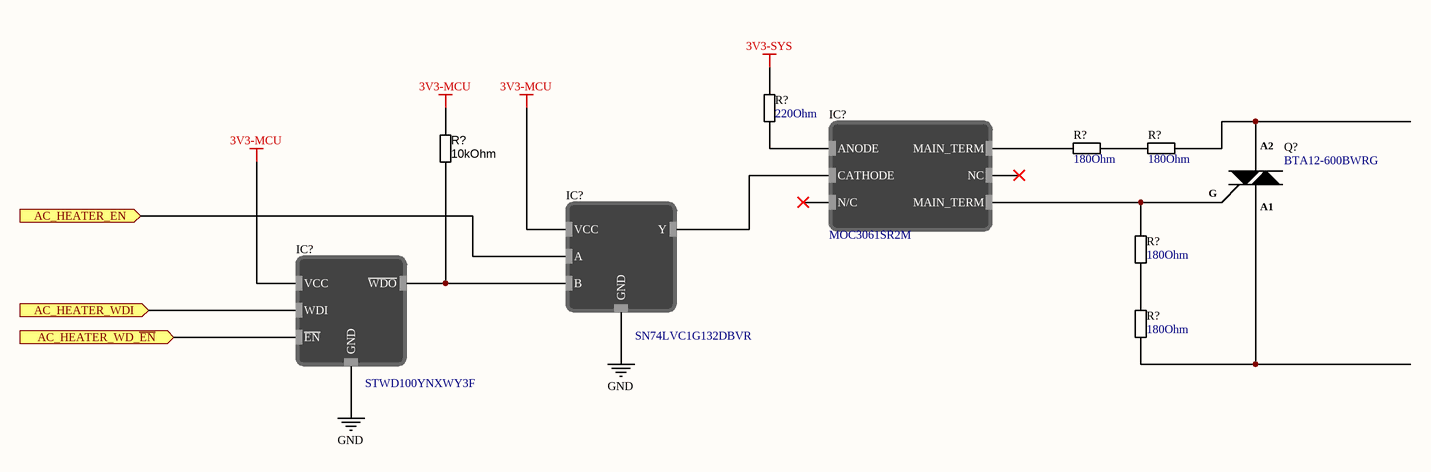
[diagram p5: AC_CONTROL.SchDoc]

### Parts
(Parts that share a designator on the sheet are numbered #1, #2 ... from top to bottom, then left to right.)
IC?#2  MOC3061SR2M  [SOT254P916X508-6N]
IC?#3  SN74LVC1G132DBVR  [SC70-5]
IC?#4  STWD100YNXWY3F  [SOT23_5]
Q?  BTA12-600BWRG  [TO-220AB_STM]
R?#2  220Ohm  [RES_0603]
R?#3  10kOhm  [RES_0603]
R?#4  180Ohm  [RES_1206]
R?#5  180Ohm  [RES_1206]
R?#6  180Ohm  [RES_1206]
R?#7  180Ohm  [RES_1206]

### Ports
AC_HEATER_EN (in), AC_HEATER_WD_~{EN} (in), AC_HEATER_WDI (in)

### Nets
3V3-MCU: IC?#3.5(VCC) IC?#4.5(VCC) R?#3.2
3V3-SYS: R?#2.2
GND: IC?#3.3(GND) IC?#4.2(GND)
NetIC?#2_1: IC?#2.1(ANODE) R?#2.1
NetIC?#2_2: IC?#2.2(CATHODE) IC?#3.4(Y)
NetIC?#2_4: IC?#2.4(MAIN_TERM) Q?.3(G) R?#6.2
NetIC?#2_6: IC?#2.6(MAIN_TERM) R?#4.1
NetIC?#3_1: IC?#3.1(A) ; port AC_HEATER_EN
NetIC?#3_2: IC?#3.2(B) IC?#4.1(~{WDO}) R?#3.1
NetIC?#4_3: IC?#4.3(~{EN}) ; port AC_HEATER_WD_~{EN}
NetIC?#4_4: IC?#4.4(WDI) ; port AC_HEATER_WDI
NetQ?_1: Q?.1(A1) R?#7.1
NetQ?_2: Q?.2(A2) R?#5.2
NetR?#4_2: R?#4.2 R?#5.1
NetR?#6_1: R?#6.1 R?#7.2

Not connected (* = marked no-connect by the designer): IC?#2 3(N/C)* 5(NC)*

### Library data of the parts
IC?#2 = MOC3061SR2M: Optoisolator Triac Output 4170Vrms 1 Channel 6-SMD; DigiKey Part Number: MOC3061SR2MCT-ND; ComponentLink1Description: DigiKey; ComponentLink1URL: https://www.digikey.com/en/products/detail/onsemi/MOC3061SR2M/401969?s=N4IgTCBcDaILIHkDCBmADANgIwGUBKYcIAugL5A; Mouser Part Number: 512-MOC3061SR2M; ComponentLink2Description: Mouser; ComponentLink2URL: https://eu.mouser.com/ProductDetail/onsemi/MOC3061SR2M?qs=QsyUFYHC2%2FbVF%2F%252BX5tJ1cA%3D%3D; Manufacturer Product Number: MOC3061SR2M; JLCPCB Part Number: C41647
IC?#3 = SN74LVC1G132DBVR: NAND Gate IC 1 Channel Schmitt Trigger SOT-23-5; DigiKey Part Number: 296-17888-1-ND; ComponentLink1Description: DigiKey; ComponentLink1URL: https://www.digikey.com/en/products/detail/texas-instruments/SN74LVC1G132DBVR/758692; Mouser Part Number: 595-SN74LVC1G132DBVR; ComponentLink2Description: Mouser; ComponentLink2URL: https://eu.mouser.com/ProductDetail/Texas-Instruments/SN74LVC1G132DBVR?qs=nqigI8dpoHLJT%252BKWcXCBlg%3D%3D; Manufacturer Product Number: SN74LVC1G132DBVR; JLCPCB Part Number: C403723
IC?#4 = STWD100YNXWY3F: Supervisor Open Drain or Open Collector 1 Channel SOT-23-5; DigiKey Part Number: 497-19691-ND; ComponentLink1Description: DigiKey; ComponentLink1URL: https://www.digikey.com/en/products/detail/stmicroelectronics/STWD100YNXWY3F/9557110?s=N4IgTCBcDaIMoBUDqARAjABgwTQHIA0QBdAXyA; Mouser Part Number: 511-STWD100YNXWY3F; ComponentLink2Description: Mouser; ComponentLink2URL: https://eu.mouser.com/ProductDetail/STMicroelectronics/STWD100YNXWY3F?qs=lYGu3FyN48fznrqImiJDzw%3D%3D; Manufacturer Product Number: STWD100YNXWY3F; JLCPCB Part Number: C1354132
Q? = 00000017: TRIAC Alternistor - Snubberless 600 V 12 A Through Hole TO-220; DigiKey Part Number: 497-3121-5-ND; Mouser Part Number: 511-BTA12-600BW; ComponentLink1Description: DigiKey; ComponentLink1URL: https://www.digikey.com/en/products/detail/stmicroelectronics/BTA12-600BWRG/654429; ComponentLink2Description: Mouser; ComponentLink2URL: https://eu.mouser.com/ProductDetail/STMicroelectronics/BTA12-600BWRG?qs=%2Fa2FmOVcLL8l0HzVHcBh3g%3D%3D; Manufacturer Product Number: BTA12-600BWRG; JLCPCB Part Number: C427100
R?#2 = R000021: 220 Ohms ±5% 0.1W, 1/10W Chip Resistor 0603 (1608 Metric) Automotive AEC-Q200 Thick Film; Manufacturer Product Number: ERJ-3GEYJ221V; ComponentLink1Description: DigiKey; ComponentLink1URL: https://www.digikey.com/en/products/detail/panasonic-electronic-components/ERJ-3GEYJ221V/135719; resistance: 220Ohm; DigiKey Part Number: P220GCT-ND
R?#3 = R000001: 10 kOhms ±1% 0.125W, 1/8W Chip Resistor 0603 (1608 Metric) Anti-Sulfur Thin Film; Manufacturer Product Number: MCT06030C1002FP500; resistance: 10kOhm; ComponentLink1Description: DigiKey; ComponentLink1URL: https://www.digikey.com/en/products/detail/vishay-beyschlag-draloric-bc-components/MCT06030C1002FP500/1850440; DigiKey Part Number: MCT0603-10.0K-CFCT-ND
R?#4-R?#7 = R000037: 180 Ohms ±5% 0.25W, 1/4W Chip Resistor 1206 (3216 Metric) Moisture Resistant Thick Film; Manufacturer Product Number: RC1206JR-07180RL; ComponentLink1Description: DigiKey; ComponentLink1URL: https://www.digikey.com/en/products/detail/yageo/RC1206JR-07180RL/729231; resistance: 180Ohm; DigiKey Part Number: 311-180ERCT-ND; JLCPCB Part Number: C137193

## Sheet MOTOR_CONTROL.SchDoc
size A2; SheetNumber: 13; SheetTotal: 16
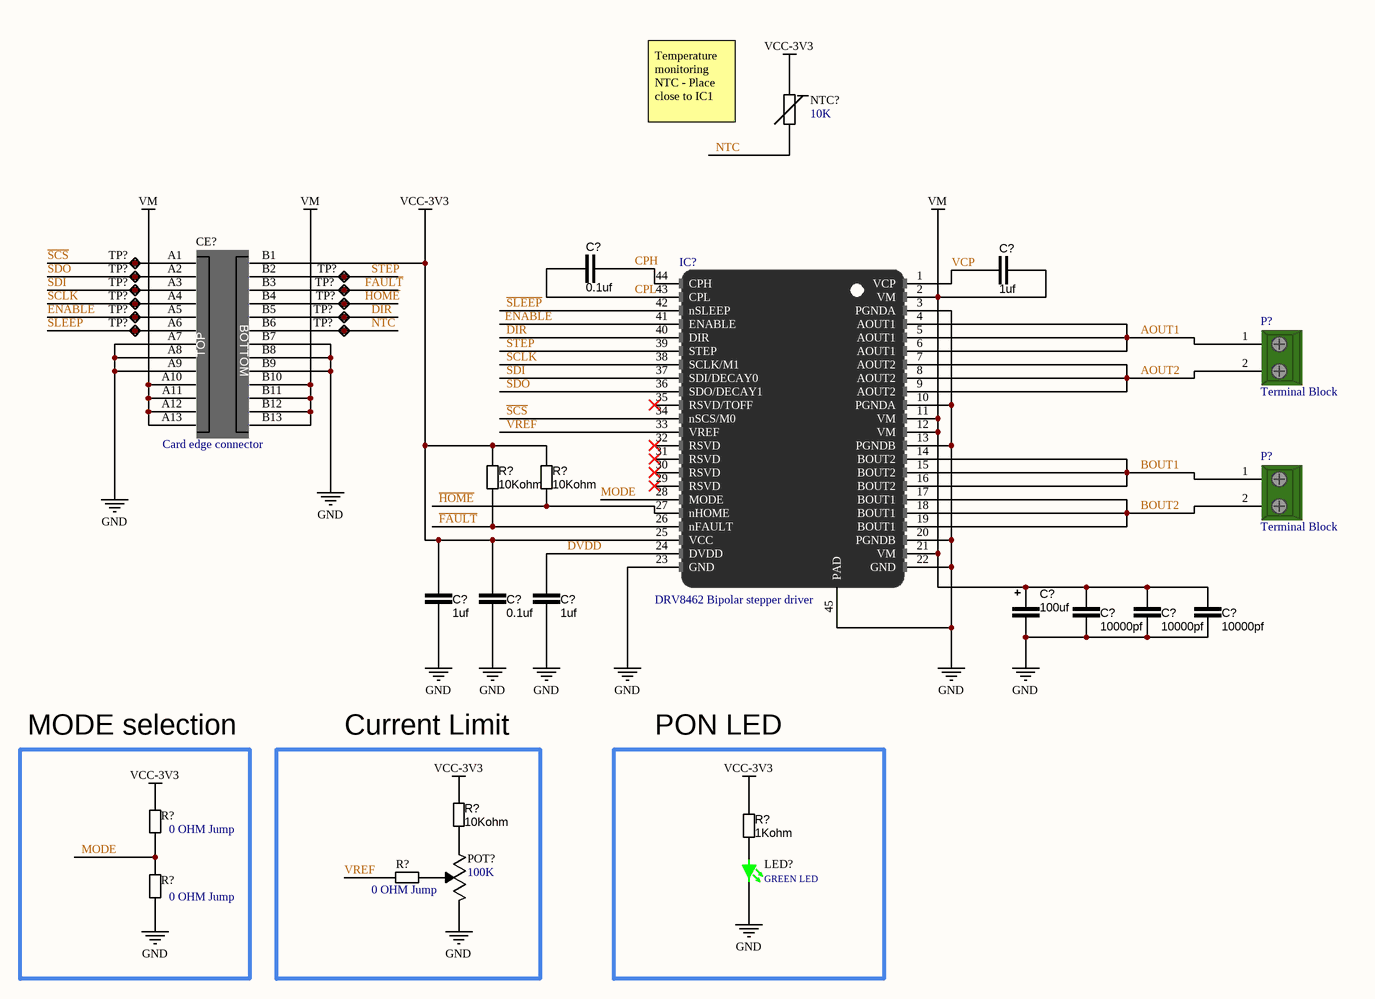
[diagram p6: MOTOR_CONTROL.SchDoc]

### Parts
(Parts that share a designator on the sheet are numbered #1, #2 ... from top to bottom, then left to right.)
C?#9  0.1uf  [CAP_0603]
C?#10  1uf  [CAP_0603]
C?#11  1uf  [CAP_0603]
C?#12  0.1uf  [CAP_0603]
C?#13  1uf  [CAP_0603]
C?#14  100uf  [CAPAE7366X60M]
C?#15  10000pf  [CAP_0603]
C?#16  10000pf  [CAP_0603]
C?#17  10000pf  [CAP_0603]
CE?  Card edge connector  [Edge Connector]
IC?#5  DRV8462 Bipolar stepper driver  [TSOP64P810X120_HS-45N]
LED?  GREEN LED  [DIOC1608X04N]
NTC?  10K  [SMD_0603]
P?#1  Terminal Block  [TERM_BLOCK 5mm 2PIN]
P?#2  Terminal Block  [TERM_BLOCK 5mm 2PIN]
POT?  100K  [TC33X-2_POT]
R?#8  10Kohm  [RES_0603]
R?#9  10Kohm  [RES_0603]
R?#10  10Kohm  [RES_0603]
R?#11  0 OHM Jump  [RES_0603]
R?#12  1Kohm  [RES_0603]
R?#13  0 OHM Jump  [RES_0603]
R?#14  0 OHM Jump  [RES_0603]
TP?#6  Test point  [TestPoint]  (value not drawn)
TP?#7  Test point  [TestPoint]  (value not drawn)
TP?#8  Test point  [TestPoint]  (value not drawn)
TP?#9  Test point  [TestPoint]  (value not drawn)
TP?#10  Test point  [TestPoint]  (value not drawn)
TP?#11  Test point  [TestPoint]  (value not drawn)
TP?#12  Test point  [TestPoint]  (value not drawn)
TP?#13  Test point  [TestPoint]  (value not drawn)
TP?#14  Test point  [TestPoint]  (value not drawn)
TP?#15  Test point  [TestPoint]  (value not drawn)
TP?#16  Test point  [TestPoint]  (value not drawn)

### Blocks framed on the sheet
MODE selection: R?#11 R?#14
Current Limit: POT? R?#10 R?#13
PON LED: LED? R?#12

### Nets
GND: C?#11.2 C?#12.1 C?#13.1 C?#14.1 C?#15.1 C?#16.1 C?#17.1 CE?.A7 CE?.A8 CE?.A9 CE?.B7 CE?.B8 CE?.B9 IC?#5.3(PGNDA) IC?#5.10(PGNDA) IC?#5.13(PGNDB) IC?#5.20(PGNDB) IC?#5.22(GND) IC?#5.23(GND) IC?#5.45(PAD) LED?.2 POT?.3 R?#14.1
VCC-3V3: C?#11.1 C?#12.2 CE?.B1 IC?#5.25(VCC) NTC?.2 R?#8.2 R?#9.2 R?#10.2 R?#11.2 R?#12.2
VM: C?#10.2 C?#14.2 C?#15.2 C?#16.2 C?#17.2 CE?.A10 CE?.A11 CE?.A12 CE?.A13 CE?.B10 CE?.B11 CE?.B12 CE?.B13 IC?#5.2(VM) IC?#5.11(VM) IC?#5.12(VM) IC?#5.21(VM)
~{FAULT}: CE?.B3 IC?#5.26(nFAULT) R?#8.1 TP?#10.1
~{HOME}: CE?.B4 IC?#5.27(nHOME) R?#9.1 TP?#12.1
~{SCS}: CE?.A1 IC?#5.34(nSCS/M0) TP?#6.1
~{SLEEP}: CE?.A6 IC?#5.42(nSLEEP) TP?#15.1
AOUT1: IC?#5.4(AOUT1) IC?#5.5(AOUT1) IC?#5.6(AOUT1) P?#1.1(pin1)
AOUT2: IC?#5.7(AOUT2) IC?#5.8(AOUT2) IC?#5.9(AOUT2) P?#1.2(pin2)
BOUT1: IC?#5.14(BOUT2) IC?#5.15(BOUT2) IC?#5.16(BOUT2) P?#2.1(pin1)
BOUT2: IC?#5.17(BOUT1) IC?#5.18(BOUT1) IC?#5.19(BOUT1) P?#2.2(pin2)
CPH: C?#9.2 IC?#5.44(CPH)
CPL: C?#9.1 IC?#5.43(CPL)
DIR: CE?.B5 IC?#5.40(DIR) TP?#14.1
DVDD: C?#13.2 IC?#5.24(DVDD)
ENABLE: CE?.A5 IC?#5.41(ENABLE) TP?#13.1
MODE: IC?#5.28(MODE) R?#11.1 R?#14.2
NTC: CE?.B6 NTC?.1 TP?#16.1
SCLK: CE?.A4 IC?#5.38(SCLK/M1) TP?#11.1
SDI: CE?.A3 IC?#5.37(SDI/DECAY0) TP?#9.1
SDO: CE?.A2 IC?#5.36(SDO/DECAY1) TP?#7.1
STEP: CE?.B2 IC?#5.39(STEP) TP?#8.1
VCP: C?#10.1 IC?#5.1(VCP)
VREF: IC?#5.33(VREF) R?#13.1
NetLED?_1: LED?.1 R?#12.1
NetPOT?_1: POT?.1 R?#10.1
NetPOT?_2: POT?.2 R?#13.2

Not connected (* = marked no-connect by the designer): IC?#5 29(RSVD)* 30(RSVD)* 31(RSVD)* 32(RSVD)* 35(RSVD/TOFF)*

### Notes on the sheet
- Temperature monitoring NTC - Place close to IC1
- (in symbol 00000007) BOTTOM; TOP

### Library data of the parts
C?#9 C?#12 = 0000012: CAP CER 0.1uF 10V X7R 0603; capaticanse: 0.1uf; ComponentLink1Description: digikey; ComponentLink1URL: https://www.digikey.com/en/products/detail/w%C3%BCrth-elektronik/885012206020/5453794; Digikey part number: 732-7939-2-ND
C?#10 C?#13 = 0000009: CAP CER 1uF 0603 16V X7R; capaticanse: 1uf; ComponentLink1Description: digikey; ComponentLink1URL: https://www.digikey.com/en/products/detail/samsung-electro-mechanics/CL10B105KO8NNNC/3886677; DigiKey part number: 1276-1019-2-ND
C?#11 = 0000011: CAP CER 1uF 10V X7R 0603; capaticanse: 1uf; ComponentLink1Description: digikey; ComponentLink1URL: https://www.digikey.com/en/products/detail/samsung-electro-mechanics/CL10B105KP8NNNC/3887604; DigiKey part number: 1276-1946-2-ND
C?#14 = 0000013: CAP ALUM POLY 100UF 20% 63V SMD; capaticanse: 100uf; ComponentLink1Description: digikey; ComponentLink1URL: https://www.digikey.com/en/products/detail/kemet/A767MU107M1JLAE028/7392906; DigiKey part number: 399-15648-2-ND
C?#15-C?#17 = 0000010: CAP CER 10000PF 63V X7R 0603; capaticanse: 10000pf; ComponentLink1Description: digikey; ComponentLink1URL: https://www.digikey.com/en/products/detail/knowles-syfer/060330630103KXT/6565244; Digikey part number: 1608-1294-2-ND
CE? = 00000007: Card edge connector 26 PINs
IC?#5 = DRV8462: 65-V, 10-A, DUAL H-BRIDGE STEPPER DRIVER; Digikey part number: 296-DRV8462DDWRTR-ND; ComponentLink1Description: DigiKey; ComponentLink1URL: https://www.digikey.com/en/products/detail/texas-instruments/DRV8462DDWR/17395001?s=N4IgTCBcDaICYCcBuAOALANggXQL5A; Mouser part number: 595-DRV8462DDWR; ComponentLink2Description: Mouser; ComponentLink2URL: https://eu.mouser.com/ProductDetail/Texas-Instruments/DRV8462DDWR?qs=rQFj71Wb1eVexvYNsDfnvA%3D%3D; ComponentLink3Description: datasheet; ComponentLink3URL: https://www.ti.com/lit/ds/symlink/drv8462.pdf
LED? = 00000001: LED GREEN DIFFUSED 0603 SMD; Supplier 1: Avnet; Supplier Part Number 1: Q65111A3964; ComponentLink1Description: Digikey; ComponentLink1URL: https://www.digikey.com/en/products/detail/ams-osram-usa-inc/LG-Q396-PS-35/5249855
NTC? = 00000003: THERMISTOR NTC 10KOHM 3380K 0603; value: 10K; Supplier 1: Arrow Electronics; Supplier Part Number 1: NCP18XH103F03RB; ComponentLink1Description: Digikey; ComponentLink1URL: https://www.digikey.com/en/products/detail/murata-electronics/NCU18XH103F6SRB/7243451
P?#1 P?#2 = 00000001: Terminal block 90 deg 5mm 2PIN; ComponentLink1Description: DigiKey; ComponentLink1URL: https://www.digikey.com/en/products/detail/adam-tech/EB20-02-C/9831508; DigiKey part number: 2057-EB20-02-C-ND
POT? = 00000002: TRIMMER 100K OHM 0.1W J LEAD TOP; Supplier 1: Arrow Electronics; Supplier Part Number 1: TC33X-2-104E; ComponentLink1Description: DigiKey; ComponentLink1URL: https://www.digikey.com/en/products/detail/bourns-inc/TC33X-2-104E/612859; Value: 100K
R?#8-R?#10 = R000001: RES 10K OHM 1% 1/10W 0603; resistance: 10Kohm; ComponentLink1Description: digikey; ComponentLink1URL: https://www.digikey.com/en/products/detail/vishay-beyschlag-draloric-bc-components/MCT06030C1002FP500/1850440
R?#11 R?#13 R?#14 = R000007: RES 0 OHM JUMPER 1/10W 0603; Supplier 1: Arrow Electronics; Supplier Part Number 1: RMCF0603ZT0R00; ComponentLink1Description: DigiKey; ComponentLink1URL: https://www.digikey.com/en/products/detail/stackpole-electronics-inc/RMCF0603ZT0R00/1756908; resistance: 0 OHM Jump
R?#12 = R000004: RES 1K OHM 1% 1/10W 0603; resistance: 1Kohm; ComponentLink1Description: digikey; ComponentLink1URL: https://www.digikey.com/en/products/detail/vishay-beyschlag-draloric-bc-components/MCT06030C1001FP500/2607821
TP?#6-TP?#16 = TP002: Test point 1mm

## Sheet 3V3_MCU.SchDoc
size A4; SheetNumber: 8; SheetTotal: 16
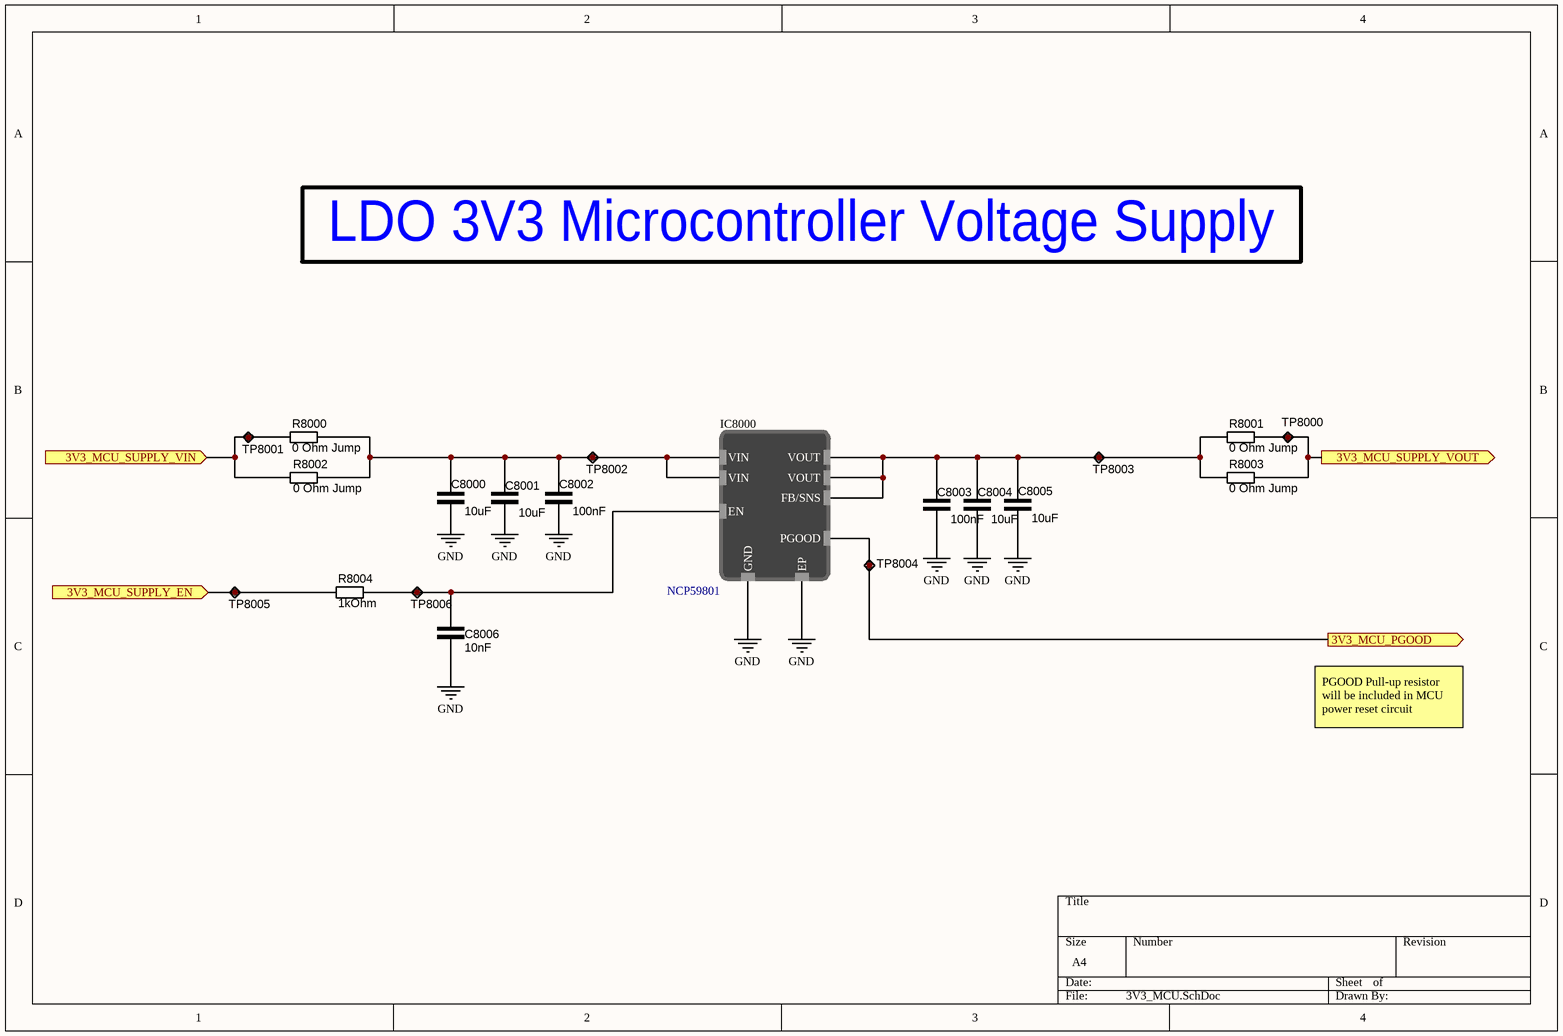
[diagram p7: 3V3_MCU.SchDoc]

### Parts
C8000  10uF  [CAP_0805]
C8001  10uF  [CAP_0805]
C8002  100nF  [CAP_0603]
C8003  100nF  [CAP_0603]
C8004  10uF  [CAP_0805]
C8005  10uF  [CAP_0805]
C8006  10nF  [CAP_0603]
IC8000  NCP59801  [DFNW8_3x3]
R8000  0 Ohm Jump  [RES_0603]
R8001  0 Ohm Jump  [RES_0805]
R8002  0 Ohm Jump  [RES_0603]
R8003  0 Ohm Jump  [RES_0805]
R8004  1kOhm  [RES_0603]
TP8000  Test point  [TestPoint]  (value not drawn)
TP8001  Test point  [TestPoint]  (value not drawn)
TP8002  Test point  [TestPoint]  (value not drawn)
TP8003  Test point  [TestPoint]  (value not drawn)
TP8004  Test point  [TestPoint]  (value not drawn)
TP8005  Test point  [TestPoint]  (value not drawn)
TP8006  Test point  [TestPoint]  (value not drawn)

### Ports
3V3_MCU_PGOOD (out, see POWER_DELIVERY_AND_MONITORING[4C]), 3V3_MCU_SUPPLY_EN (in, see POWER_DELIVERY_AND_MONITORING[4C]), 3V3_MCU_SUPPLY_VIN (in, see POWER_DELIVERY_AND_MONITORING[4C]), 3V3_MCU_SUPPLY_VOUT (out, see POWER_DELIVERY_AND_MONITORING[4C], POWER_DELIVERY_AND_MONITORING[4B])

### Nets
GND: C8003.1 C8004.1 C8005.2 C8006.1 IC8000.4(GND) IC8000.9(EP)
NetC8000_1: C8000.1 C8001.2 C8002.1 IC8000.7(VIN) IC8000.8(VIN) R8000.2 R8002.1 TP8002.1
NetC8003_2: C8003.2 C8004.2 C8005.1 IC8000.1(VOUT) IC8000.2(VOUT) IC8000.3(FB/SNS) R8001.1 R8003.1 TP8003.1
NetC8006_2: C8006.2 IC8000.5(EN) R8004.2 TP8006.1
NetIC8000_6: IC8000.6(PGOOD) TP8004.1 ; port 3V3_MCU_PGOOD
NetR8000_1: R8000.1 R8002.2 TP8001.1 ; port 3V3_MCU_SUPPLY_VIN
NetR8001_2: R8001.2 R8003.2 TP8000.1 ; port 3V3_MCU_SUPPLY_VOUT
NetR8004_1: R8004.1 TP8005.1 ; port 3V3_MCU_SUPPLY_EN

Not connected (* = marked no-connect by the designer): C8000 2; C8001 1; C8002 2

### Notes on the sheet
- LDO 3V3 Microcontroller Voltage Supply
- PGOOD Pull-up resistor will be included in MCU power reset circuit
- Labels drawn without touching a wire or pin: GND

### Library data of the parts
C8000 C8001 C8004 C8005 = C000002: as C5000 on sheet 5V_SUPPLY; ComponentLink1Description: DigiKey; ComponentLink1URL: https://www.digikey.com/en/products/detail/tdk-corporation/C2012X5R1E106K125AB/2443462; DigiKey Part Number: 445-5984-1-ND; capacitance: 10uF
C8002 C8003 = C000007: as C5002 on sheet 5V_SUPPLY; ComponentLink1Description: DigiKey; ComponentLink1URL: https://www.digikey.com/en/products/detail/kyocera-avx/06033C104K4T2A/8019250; DigiKey Part Number: 478-KAM15AR71E104KTCT-ND; capacitance: 100nF
C8006 = C000005: as C5011 on sheet 5V_SUPPLY; ComponentLink1Description: DigiKey; ComponentLink1URL: https://www.digikey.com/en/products/detail/kyocera-avx/06033C103MAT2A/1599370; DigiKey Part Number: 478-KGM15AR71E103MTCT-ND; capacitance: 10nF
IC8000 = NCP59801: Linear Voltage Regulator IC Positive Fixed 1 Output 1A 8-DFNW (3x3); Manufacturer Product Number: NCP59801CML330TCG; DigiKey Part Number: 488-NCP59801CML330TCGCT-ND; ComponentLink1Description: DigiKey; ComponentLink1URL: https://www.digikey.com/en/products/detail/onsemi/NCP59801CML330TCG/17868225; Mouser Part Number: 863-CP59801CML330TCG; ComponentLink2Description: Mouser; ComponentLink2URL: https://eu.mouser.com/ProductDetail/onsemi/NCP59801CML330TCG?qs=vvQtp7zwQdM1Va2lUiPUkg%3D%3D; JLCPCB Part Number: C5209184
R8000 R8002 = R000007: as R5004 on sheet 5V_SUPPLY; ComponentLink1Description: DigiKey; ComponentLink1URL: https://www.digikey.com/en/products/detail/stackpole-electronics-inc/RMCF0603ZT0R00/1756908; resistance: 0 Ohm Jump; DigiKey Part Number: RMCF0603ZT0R00CT-ND
R8001 R8003 = R000011: as R5000 on sheet 5V_SUPPLY; ComponentLink1Description: DigiKey; ComponentLink1URL: https://www.digikey.com/en/products/detail/panasonic-electronic-components/ERJ-6GEY0R00V/78163; resistance: 0 Ohm Jump; DigiKey Part Number: P0.0ACT-ND
R8004 = R000004: as R5005 on sheet 5V_SUPPLY; resistance: 1kOhm; ComponentLink1Description: DigiKey; ComponentLink1URL: https://www.digikey.com/en/products/detail/vishay-beyschlag-draloric-bc-components/MCT06030C1001FP500/2607821; DigiKey Part Number: MCT0603-1.00K-CFCT-ND
TP8000-TP8006 = TP002: Test point 1mm

## Nets that join several sheets
GND: REVERSE_PROTECTION (15 pins), 5V_SUPPLY (14 pins), 5V_ISOLATED_SUPPLY (7 pins), uSD_CARD (10 pins), DISPLAY_INTERFACE (6 pins), AC_CONTROL (IC?#3.3 IC?#4.2), MOTOR_CONTROL (23 pins), 3V3_MCU (6 pins)